# EAGLE schematic M0519SD3AE_breakout_v1 (EAGLE 9.2.2)
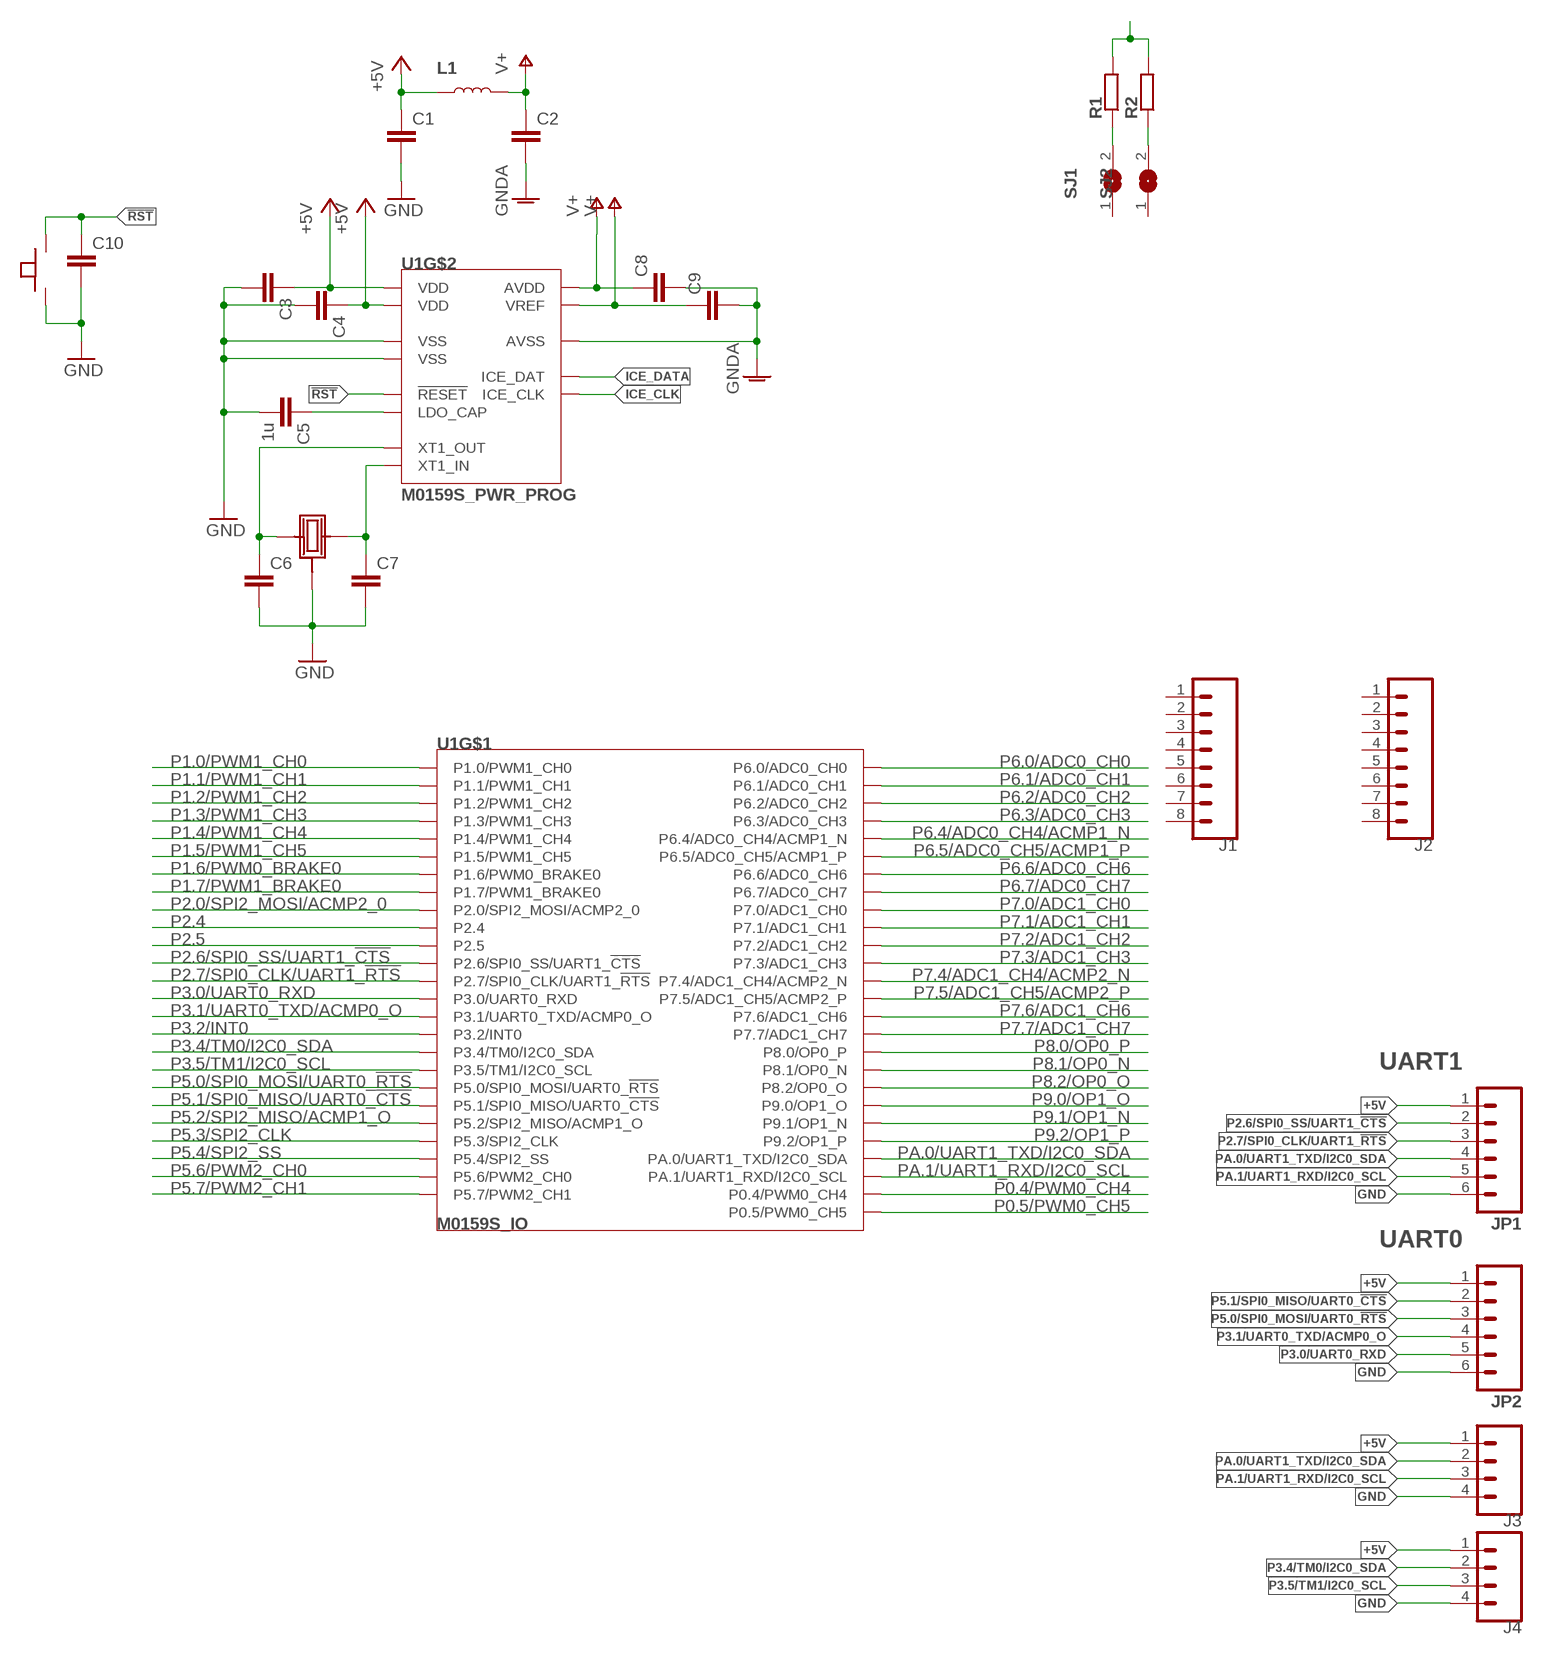
[diagram p0: schematic, sheet 1]

## Parts
C1  CAP0603-CAP  [0603-CAP]
C2  CAP0603-CAP  [0603-CAP]
C3  CAP0603-CAP  [0603-CAP]
C4  CAP0603-CAP  [0603-CAP]
C5  1u  CAP0603-CAP  [0603-CAP]
C6  CAP0603-CAP  [0603-CAP]
C7  CAP0603-CAP  [0603-CAP]
C8  CAP0603-CAP  [0603-CAP]
C9  CAP0603-CAP  [0603-CAP]
C10  CAP0603-CAP  [0603-CAP]
J1  M08  [1X08]
J2  M08  [1X08]
J3  M04  [1X04]
J4  M04  [1X04]
JP1  M06LOCK  [1X06_LOCK]
JP2  M06LOCK  [1X06_LOCK]
L1  INDUCTOR_FB  [0603-FB]
R1  RESISTOR0603-RES  [0603-RES]
R2  RESISTOR0603-RES  [0603-RES]
SJ1  SJ  [SJ]
SJ2  SJ  [SJ]
U1  M0159S  [LQFP-64_7MMX7MMX1.6MM]
U$1  CRYSTAL_EPSON  [TSX3225]
U$2  95C06B2GWRT  [PUSH-BUTTON-95C06B2GWRT]

## Nets
!RST: C10.1 U1.60(!RESET) U$2.P3(B) U$2.P4(B)
+5V: C1.1 C3.1 C4.1 J3.1 J4.1 JP1.1 JP2.1 L1.1 U1.6(VDD) U1.21(VDD)
GND: C1.2 C3.2 C4.2 C5.2 C6.2 C7.2 C10.2 J3.4 J4.4 JP1.6 JP2.6 U1.7(VSS) U1.22(VSS) U$1.2 U$1.4 U$2.P1(A) U$2.P2(A)
GNDA: C2.2 C8.2 C9.2 U1.46(AVSS)
ICE_CLK: U1.64(ICE_CLK)
ICE_DATA: U1.63(ICE_DAT)
N$1: R1.1 SJ1.2
N$2: C5.1 U1.5(LDO_CAP)
N$3: C7.1 U1.62(XT1_IN) U$1.1
N$4: C6.1 U1.61(XT1_OUT) U$1.3
N$5: R2.1 SJ2.2
N$6: R1.2 R2.2
P0.4/PWM0_CH4: U1.30(P0.4/PWM0_CH4)
P0.5/PWM0_CH5: U1.29(P0.5/PWM0_CH5)
P1.0/PWM1_CH0: U1.18(P1.0/PWM1_CH0)
P1.1/PWM1_CH1: U1.17(P1.1/PWM1_CH1)
P1.2/PWM1_CH2: U1.16(P1.2/PWM1_CH2)
P1.3/PWM1_CH3: U1.15(P1.3/PWM1_CH3)
P1.4/PWM1_CH4: U1.14(P1.4/PWM1_CH4)
P1.5/PWM1_CH5: U1.13(P1.5/PWM1_CH5)
P1.6/PWM0_BRAKE0: U1.12(P1.6/PWM0_BRAKE0)
P1.7/PWM1_BRAKE0: U1.4(P1.7/PWM1_BRAKE0)
P2.0/SPI2_MOSI/ACMP2_0: U1.31(P2.0/SPI2_MOSI/ACMP2_0)
P2.4: U1.28(P2.4)
P2.5: U1.27(P2.5)
P2.6/SPI0_SS/UART1_!CTS: JP1.2 U1.26(P2.6/SPI0_SS/UART1_!CTS)
P2.7/SPI0_CLK/UART1_!RTS: JP1.3 U1.25(P2.7/SPI0_CLK/UART1_!RTS)
P3.0/UART0_RXD: JP2.5 U1.19(P3.0/UART0_RXD)
P3.1/UART0_TXD/ACMP0_O: JP2.4 U1.20(P3.1/UART0_TXD/ACMP0_O)
P3.2/INT0: U1.3(P3.2/INT0)
P3.4/TM0/I2C0_SDA: J4.2 U1.2(P3.4/TM0/I2C0_SDA)
P3.5/TM1/I2C0_SCL: J4.3 U1.1(P3.5/TM1/I2C0_SCL)
P5.0/SPI0_MOSI/UART0_!RTS: JP2.3 U1.23(P5.0/SPI0_MOSI/UART0_!RTS)
P5.1/SPI0_MISO/UART0_!CTS: JP2.2 U1.24(P5.1/SPI0_MISO/UART0_!CTS)
P5.2/SPI2_MISO/ACMP1_O: U1.32(P5.2/SPI2_MISO/ACMP1_O)
P5.3/SPI2_CLK: U1.33(P5.3/SPI2_CLK)
P5.4/SPI2_SS: U1.34(P5.4/SPI2_SS)
P5.6/PWM2_CH0: U1.11(P5.6/PWM2_CH0)
P5.7/PWM2_CH1: U1.10(P5.7/PWM2_CH1)
P6.0/ADC0_CH0: U1.42(P6.0/ADC0_CH0)
P6.1/ADC0_CH1: U1.41(P6.1/ADC0_CH1)
P6.2/ADC0_CH2: U1.40(P6.2/ADC0_CH2)
P6.3/ADC0_CH3: U1.39(P6.3/ADC0_CH3)
P6.4/ADC0_CH4/ACMP1_N: U1.38(P6.4/ADC0_CH4/ACMP1_N)
P6.5/ADC0_CH5/ACMP1_P: U1.37(P6.5/ADC0_CH5/ACMP1_P)
P6.6/ADC0_CH6: U1.36(P6.6/ADC0_CH6)
P6.7/ADC0_CH7: U1.35(P6.7/ADC0_CH7)
P7.0/ADC1_CH0: U1.56(P7.0/ADC1_CH0)
P7.1/ADC1_CH1: U1.55(P7.1/ADC1_CH1)
P7.2/ADC1_CH2: U1.54(P7.2/ADC1_CH2)
P7.3/ADC1_CH3: U1.53(P7.3/ADC1_CH3)
P7.4/ADC1_CH4/ACMP2_N: U1.52(P7.4/ADC1_CH4/ACMP2_N)
P7.5/ADC1_CH5/ACMP2_P: U1.51(P7.5/ADC1_CH5/ACMP2_P)
P7.6/ADC1_CH6: U1.50(P7.6/ADC1_CH6)
P7.7/ADC1_CH7: U1.49(P7.7/ADC1_CH7)
P8.0/OP0_P: U1.45(P8.0/OP0_P)
P8.1/OP0_N: U1.44(P8.1/OP0_N)
P8.2/OP0_O: U1.43(P8.2/OP0_O)
P9.0/OP1_O: U1.57(P9.0/OP1_O)
P9.1/OP1_N: U1.58(P9.1/OP1_N)
P9.2/OP1_P: U1.59(P9.2/OP1_P)
PA.0/UART1_TXD/I2C0_SDA: J3.2 JP1.4 U1.9(PA.0/UART1_TXD/I2C0_SDA)
PA.1/UART1_RXD/I2C0_SCL: J3.3 JP1.5 U1.8(PA.1/UART1_RXD/I2C0_SCL)
V+: C2.1 C8.1 C9.1 L1.2 U1.47(AVDD) U1.48(VREF)
Unconnected: J1.1 J1.2 J1.3 J1.4 J1.5 J1.6 J1.7 J1.8 J2.1 J2.2 J2.3 J2.4 J2.5 J2.6 J2.7 J2.8 SJ1.1 SJ2.1

## Notes on the sheet
- UART1
- UART0

## Library data of the parts
C1-C10 = DRances:CAP: Capacitor
J1 J2 = DRances:M08
J3 J4 = DRances:M04
JP1 JP2 = DRances:M06: Header 6 Standard 6-pin 0.1" header. Use with straight break away headers (SKU : PRT-00116), right angle break away headers (PRT-00553), swiss pins (PRT-00743), machine pins (PRT-00117), and female headers (PRT-00115). Molex polarized connector foot print use with SKU : PRT-08094 with associated crimp pins and housings. NOTES ON THE VARIANTS LOCK and LOCK_LONGPADS... This footprint was designed to help hold the alignment of a through-hole component (i.e. 6-pin header) while soldering it into place. You may notice that each hole has been shifted either up or down by 0.005 of an inch from it's more standard position (which is a perfectly straight line). This slight alteration caused the pins (the squares in the middle) to touch the edges of the holes. Because they are alternating, it causes a "brace" to hold the component in place. 0.005 has proven to be the perfect amount of "off-center" position when using our standard breakaway headers. Although looks a little odd when you look at the bare footprint, once you have a header in there, the alteration is very hard to notice. Also, if you push a header all the way into place, it is covered up entirely on the bottom side. This idea of altering the position of holes to aid alignment will be further integrated into the Sparkfun Library for other footprints. It can help hold any component with 3 or more connection pins.
L1 = DRances:INDUCTOR_FB
R1 R2 = DRances:RESISTOR: Resistor Basic schematic elements and footprints for 0603, 1206, and PTH 1/10th watt (small) resistors.
SJ1 SJ2 = DRances:SJ: SMD solder JUMPER
U1 = Nuvoton:M0159S
U$1 = DRances:CRYSTAL_EPSON
U$2 = DRances:95C06B2GWRT: 95C06B2GWRT Grayhill Tactile Pushbutton https://www2.mouser.com/datasheet/2/626/Tact_95C06-335474.pdf